# EAGLE design WiFi RoboCut v1 (EAGLE 7.7.0)
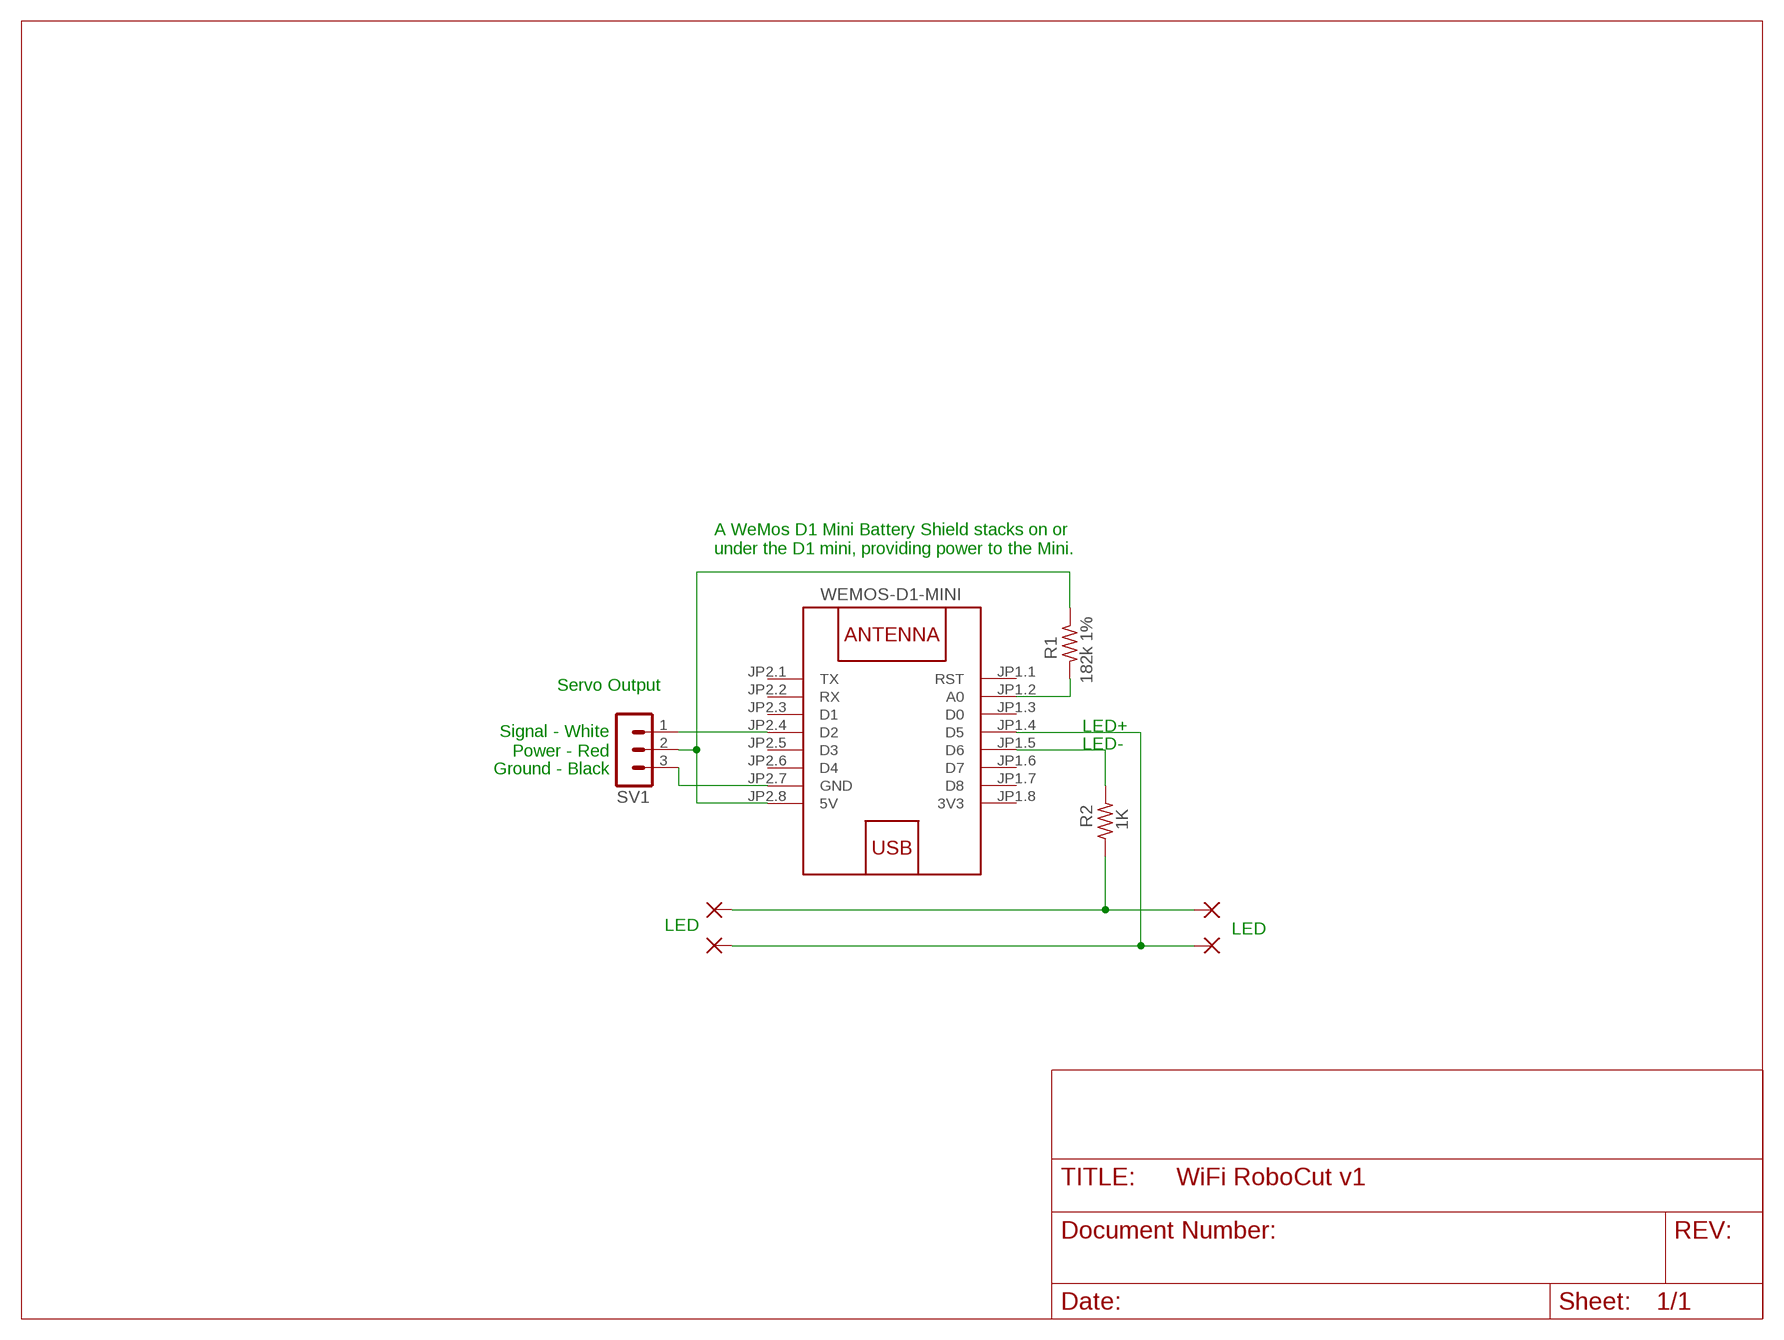
[diagram p0: schematic, sheet 1]

## Parts
PAD1  2,15/1,0  [2,15/1,0]
PAD2  2,15/1,0  [2,15/1,0]
PAD3  2,15/1,0  [2,15/1,0]
PAD4  2,15/1,0  [2,15/1,0]
R1  182k 1%  R-US_R1206  [R1206]
R2  1K  R-US_R1206  [R1206]
SV1  MA03-1  [MA03-1]
U$1  WEMOS-D1-MINI  [WEMOS-D1-MINI]

## Nets
GND: SV1.3 U$1.JP2.7(GND)
N$1: R1.2 U$1.JP1.2(A0)
N$2: SV1.1 U$1.JP2.4(D2)
N$7: PAD1.1(P) PAD3.1(P) R2.1
N$9: PAD2.1(P) PAD4.1(P) U$1.JP1.4(D5)
N$11: R2.2 U$1.JP1.5(D6)
VCC: R1.1 SV1.2 U$1.JP2.8(5V)
Unconnected: U$1.JP1.1(RST) U$1.JP1.3(D0) U$1.JP1.6(D7) U$1.JP1.7(D8) U$1.JP2.1(TX) U$1.JP2.2(RX) U$1.JP2.3(D1) U$1.JP2.5(D3) U$1.JP2.6(D4)

## Notes on the sheet
- A WeMos D1 Mini Battery Shield stacks on or 
  under the D1 mini, providing power to the Mini.
- Servo Output
- Signal - White
- LED+
- Power - Red
- LED-
- Ground - Black
- LED | LED

## Power pins joined to a net without a drawn wire
3V3: U$1.JP1.8(3V3)

## Library data of the parts
PAD1-PAD4 = wirepad:2,15/1,0: THROUGH-HOLE PAD
R1 R2 = rcl:R-US_: RESISTOR, American symbol
SV1 = con-lstb:MA03-1: PIN HEADER; OC_FARNELL: unknown; OC_NEWARK: unknown
U$1 = diy-modules:WEMOS-D1-MINI: WEMOS D1 mini: Mini Wi-Fi Board based on ESP-8266 device More details can be found here: https://www.wemos.cc/product/d1-mini.html Click here to find device on ebay.com <http://www.ebay.com/sch/wemos+d1+mini+nodemcu>

## Board
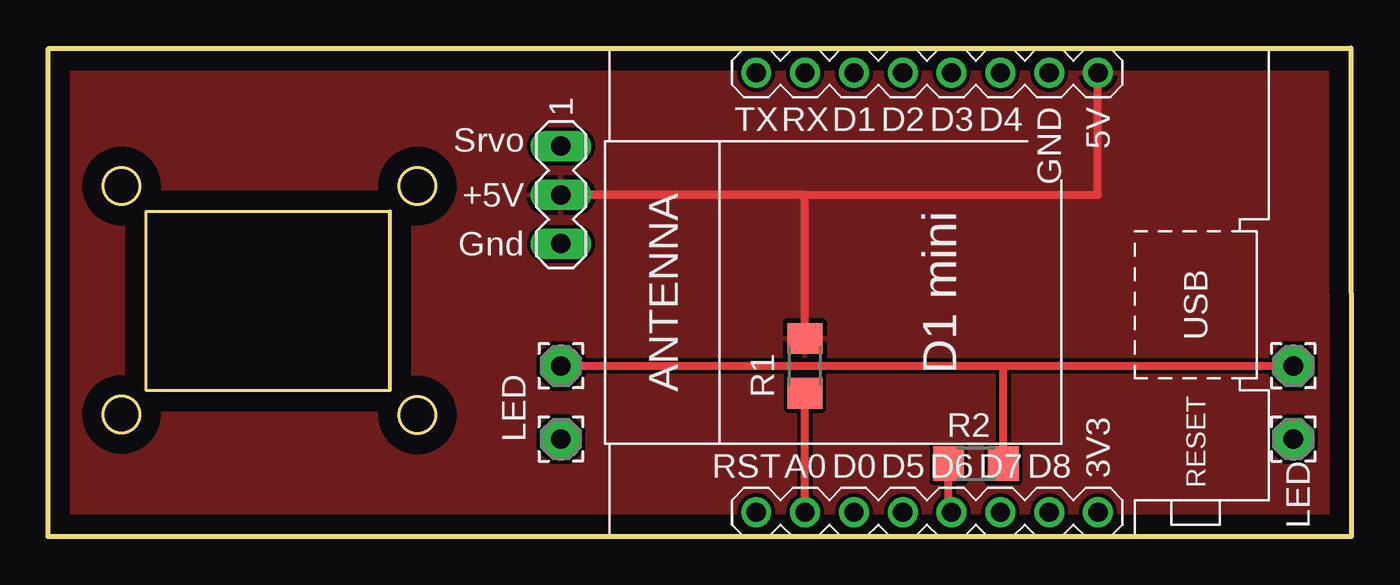
[diagram p1: board, top side]
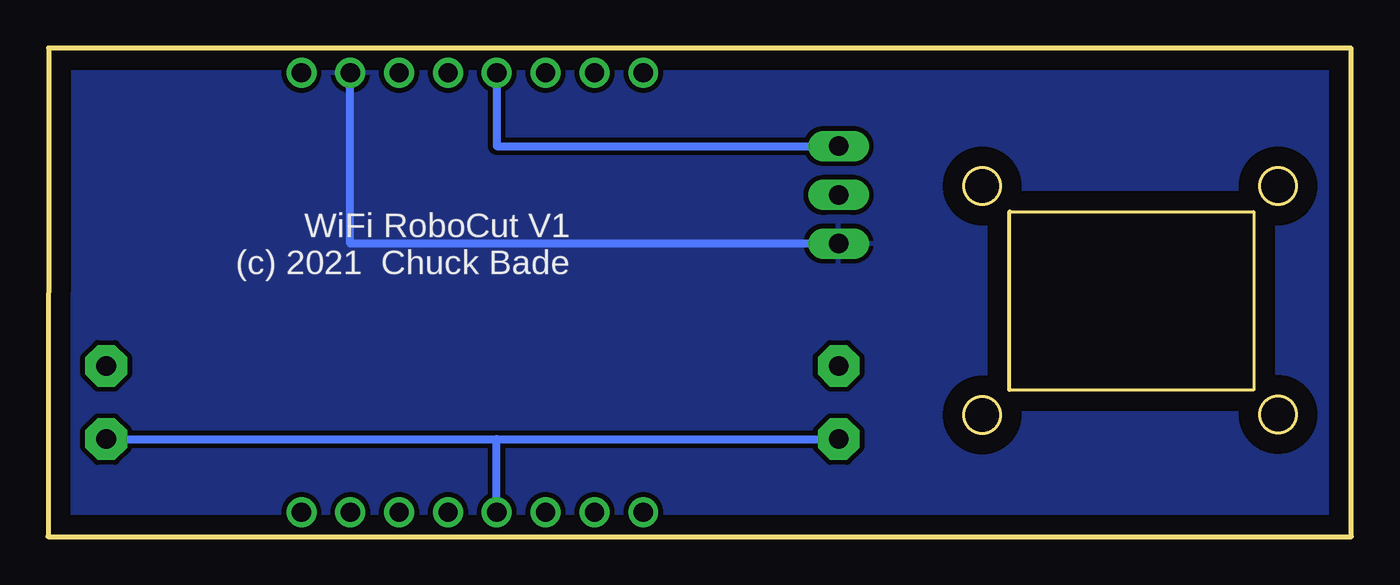
[diagram p2: board, bottom side, seen from below]

Size 67.81 x 25.41 mm. Coordinates in mm from the lower left corner, seen from the top.
Outline: 0.01,25.4 67.78,25.41 67.81,0 0,0 0.01,25.4
Outline: 5.09,7.62 17.79,7.62 17.79,16.91 5.09,16.91 5.09,7.62
Outline: circle at 3.82,6.35 radius 0.95
Outline: circle at 19.22,6.33 radius 0.95
Outline: circle at 3.82,18.25 radius 0.95
Outline: circle at 19.22,18.23 radius 0.95
Copper layers (1*16): Top 0.035mm / dielectric 1.5mm / Bottom 0.035mm
Design rules "default *": minimum track width 10mil, minimum drill 10mil, track to track 8mil, track to pad 8mil, pad to pad 8mil, via to via 8mil, smd to smd 8mil, copper to edge 40mil, drill to drill 8mil, minimum pad ring 11mil, minimum via ring 8mil, stop-mask expansion 4mil, vias tented up to drill 0mil, thermal gap 10mil

### Footprints (pad centres in the part's own frame; a part is rotated, then mirrored left to right if it is on the bottom)
2,15/1,0 = drill 1.016 pad 2.159 octagon: 1 0,0
R1206 = smd 1.6 x 1.803: 1 -1.422,0; 2 1.422,0
MA03-1 = drill 1.016 long: 1 -2.54,0; 2 0,0; 3 2.54,0
WEMOS-D1-MINI = drill 1: JP1.1 -11.43,9.525; JP1.2 -11.43,6.985; JP1.3 -11.43,4.445; JP1.4 -11.43,1.905; JP1.5 -11.43,-0.635; JP1.6 -11.43,-3.175; JP1.7 -11.43,-5.715; JP1.8 -11.43,-8.255; JP2.1 11.43,9.525; JP2.2 11.43,6.985; JP2.3 11.43,4.445; JP2.4 11.43,1.905; JP2.5 11.43,-0.635; JP2.6 11.43,-3.175; JP2.7 11.43,-5.715; JP2.8 11.43,-8.255

### Placement (x,y rotation side)
PAD1  64.78,8.89 0 top
PAD2  64.78,5.08 0 top
PAD3  26.68,8.89 0 top
PAD4  26.68,5.08 0 top
R1  39.38,8.89 270 top
R2  48.27,3.81 180 top
SV1  26.68,17.78 270 top
U$1  46.37,12.7 90 top

### Tracks (layer width: path | path; a pad name or v marks a point on that pad's centre or on a via)
GND
  Bottom 0.406: SV1.3 52.08,15.24 U$1.JP2.7
  pour Bottom (isolate 0.254): -0.49,26 68.01,26 68.01,-0.5 -0.49,-0.5
N$1
  Top 0.406: U$1.JP1.2 R1.2
N$2
  Bottom 0.406: U$1.JP2.4 44.46,20.32 SV1.1
N$7
  Top 0.406: R2.1 49.69,8.89 | 49.69,8.89 PAD1.1 | PAD3.1 49.69,8.89
N$9
  Bottom 0.406: U$1.JP1.4 44.46,5.08 | 44.46,5.08 PAD4.1 | PAD2.1 44.46,5.08
N$11
  Top 0.406: U$1.JP1.5 46.85,1.27 R2.2
VCC
  Top 0.406: R1.1 39.38,17.78 SV1.2 54.62,17.78 U$1.JP2.8
  pour Top: -1.26,26.67 68.59,26.67 68.59,-1.27 -1.26,-1.27

### Text on the board
tOrigins: Surface Mount Parts / R1 182K / R2 1K
tNames: Srvo | +5V | Gnd | LED | LED
bNames: WiFi RoboCut V1 / (c) 2021 Chuck Bade